# Altium schematic sheet Sheet1.SchDoc: 333
size A3; Organization: IMEC; DocumentNumber: 222; SheetNumber: ?; SheetTotal: ?; PageSetup: Record=PageOptions|CenterHorizontal=True|CenterVertical=True|PrintScale=1.00|XCorrection=1.00|YCorrection=1.00|PrintKind=0|BorderSize=5000000|LeftOffset=0|BottomOffset=0|Orientation=2|PaperLength=2970|PaperWidth=2100|Scale=100|PaperSource=1|PrintQuality=300|MediaType=1|DitherType=10|PaperKind=A3|PrintScaleMode=1; ProjectName: 222
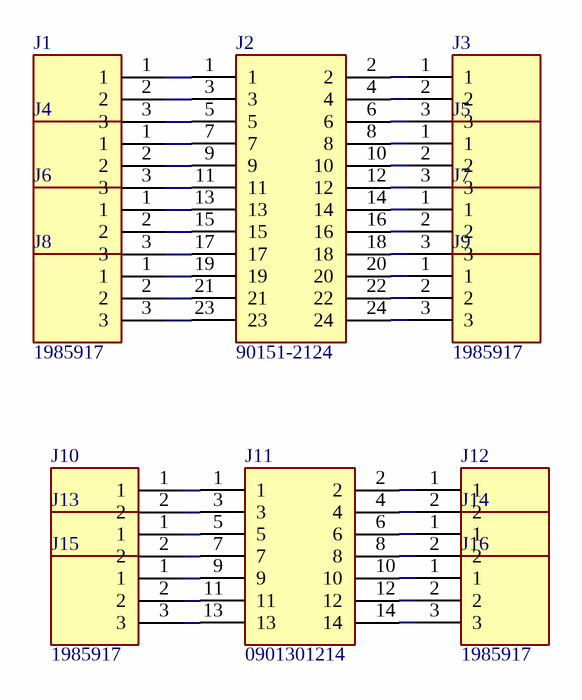
[diagram p0: Sheet1.SchDoc]

## Parts
J1  1985917  [1985917]
J2  90151-2124  [RHDR24W64P254_2X12_3033X498X870P]
J3  1985917  [1985917]
J4  1985917  [1985917]
J5  1985917  [1985917]
J6  1985917  [1985917]
J7  1985917  [1985917]
J8  1985917  [1985917]
J9  1985917  [1985917]
J10  1711725  [1711725]
J11  0901301214  [SHDR14W65P254_2X7_2012X975X1110P]
J12  1711725  [1711725]
J13  1711725  [1711725]
J14  1711725  [1711725]
J15  1985917  [1985917]
J16  1985917  [1985917]

## Nets
NetJ1_1: J1.1 J2.1
NetJ1_2: J1.2 J2.3
NetJ1_3: J1.3 J2.5
NetJ2_2: J2.2 J3.1
NetJ2_4: J2.4 J3.2
NetJ2_6: J2.6 J3.3
NetJ2_7: J2.7 J4.1
NetJ2_8: J2.8 J5.1
NetJ2_9: J2.9 J4.2
NetJ2_10: J2.10 J5.2
NetJ2_11: J2.11 J4.3
NetJ2_12: J2.12 J5.3
NetJ2_13: J2.13 J6.1
NetJ2_14: J2.14 J7.1
NetJ2_15: J2.15 J6.2
NetJ2_16: J2.16 J7.2
NetJ2_17: J2.17 J6.3
NetJ2_18: J2.18 J7.3
NetJ2_19: J2.19 J8.1
NetJ2_20: J2.20 J9.1
NetJ2_21: J2.21 J8.2
NetJ2_22: J2.22 J9.2
NetJ2_23: J2.23 J8.3
NetJ2_24: J2.24 J9.3
NetJ10_1: J10.1 J11.1
NetJ10_2: J10.2 J11.3
NetJ11_2: J11.2 J12.1
NetJ11_4: J11.4 J12.2
NetJ11_5: J11.5 J13.1
NetJ11_6: J11.6 J14.1
NetJ11_7: J11.7 J13.2
NetJ11_8: J11.8 J14.2
NetJ11_9: J11.9 J15.1
NetJ11_10: J11.10 J16.1
NetJ11_11: J11.11 J15.2
NetJ11_12: J11.12 J16.2
NetJ11_13: J11.13 J15.3
NetJ11_14: J11.14 J16.3

## Notes on the sheet
- Project Name:
- Kapeldreef 75
- PBA Name:
- Rev-Var:
- Seq:
- Designed by:
- 3001 Heverlee
- Belgium
- www.imec.be
- Approved:
- File Name:
- Sheet:
- /
- Date:

## Library data of the parts
J1 J3-J9 J15 J16 = 1985917: PCB Terminal Block 1985917; Manufacturer_Name: Phoenix Contact; Geometry.Height: 13.95mm; TTI Part Number: *; TTI Price/Stock: *; Manufacturer_Part_Number: 1985917; Datasheet Link: https://media.digikey.com/pdf/Data%20Sheets/Phoenix%20Contact%20PDFs/Multi-Postion%20PCTerminal%20Blocks.pdf
J2 = 90151-2124: Headers & Wire Housings C-Grid PCB Conn DR Vt Tn-A 24Ckt; Manufacturer_Name: Molex; Geometry.Height: 8.7mm; TTI Part Number: *; TTI Price/Stock: *; Manufacturer_Part_Number: 90151-2124; Datasheet Link: https://www.molex.com/pdm_docs/sd/901512124_sd.pdf
J10 J12-J14 = 1711725: PCB terminal block, nominal current: 24 A, rated voltage (III/2): 400 V, nominal cross section: 2.5 mm?, Number of potentials: 2, Number of rows: 1, Number of positions per row: 2, product range: MKDS 3, pitch: 5.08 mm, connection method: Screw connection with tension sleeve, mounting: Wave soldering, conductor/PCB connection direction: 0 ?, color: green, Pin layout: Linear pinning, Solder pin [P]: 5 mm, type of packaging: packed in cardboard. The article can be aligned to create different nos. of positions; Manufacturer_Name: Phoenix Contact; Geometry.Height: 18.2mm; TTI Part Number: *; TTI Price/Stock: *; Manufacturer_Part_Number: 1711725; Datasheet Link: http://www.phoenixcontact.net/product/1711725
J11 = 0901301214: Headers & Wire Housings C-GRID III 2.54MM VT SHRD 2X07; Manufacturer_Name: Molex; Geometry.Height: 11.1mm; TTI Part Number: *; TTI Price/Stock: *; Manufacturer_Part_Number: 0901301214; Datasheet Link: https://www.molex.com/pdm_docs/sd/901301214_sd.pdf